# EAGLE schematic relay-simple (EAGLE 6.4)
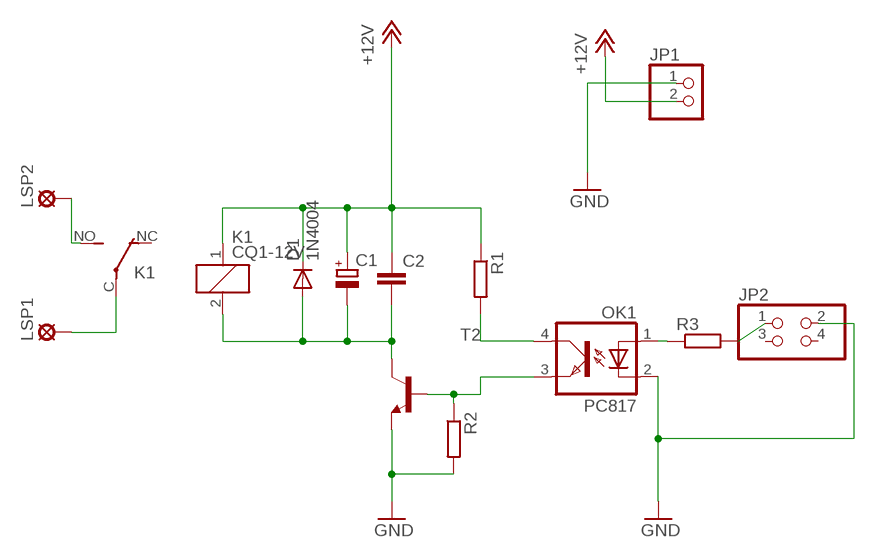
[diagram p0: schematic, sheet 1]

## Parts
C1  CPOL-EUE2-5  [E2-5]
C2  C-EUC1206  [C1206]
D1  1N4004  [DO41-10]
JP1  PINHD-1X2  [1X02]
JP2  PINHD-2X2  [2X02]
K1  CQ1-12V  [CQ1]
LSP1  LSP10  [LSP10]
LSP2  LSP10  [LSP10]
OK1  PC817  [DIL04]
R1  R-EU_R1206  [R1206]
R2  R-EU_R1206  [R1206]
R3  R-EU_R1206  [R1206]
T2  -NPN-TO92  [TO92]

## Nets
+12V: C1.+ C2.1 D1.C JP1.2 K1.1 R1.1
GND: JP1.1 JP2.2 OK1.2(C) R2.2 T2.1(E)
N$1: OK1.3(EMIT) R2.1 T2.2(B)
N$2: C1.- C2.2 D1.A K1.2 T2.3(C)
N$3: OK1.4(COL) R1.2
N$4: OK1.1(A) R3.1
N$5: JP2.1 R3.2
N$6 [power]: K1.C(2:P) LSP1.MP
N$7 [power]: K1.NO(2:S) LSP2.MP
Unconnected: JP2.3 JP2.4 K1.NC(2:O)

## Library data of the parts
C1 = rcl:CPOL-EU: POLARIZED CAPACITOR, European symbol
C2 = rcl:C-EU: CAPACITOR, European symbol
D1 = diode:1N4004: DIODE general purpose rectifier, 1 A
JP1 = pinhead:PINHD-1X2: PIN HEADER
JP2 = pinhead:PINHD-2X2: PIN HEADER
K1 = relay:CQ1-12V: AUTOMOTIVE QUIET RELAY NAiS Source: http://www.mew-europe.com/.. en_ds_61208_0000.pdf; OC_FARNELL: unknown; OC_NEWARK: unknown
LSP1 LSP2 = solpad:LSP10: SOLDER PAD drill 1.0 mm, distributor Buerklin, 12H555
OK1 = optocoupler:PC817: SHARP OPTO COUPLER; MPN: PC817X4J000F; OC_FARNELL: 9707727; OC_NEWARK: 97K7059
R1-R3 = rcl:R-EU_: RESISTOR, European symbol
T2 = transistor:*-NPN-: NPN Transistror BF959 corrected 2008.03.06

## Net classes
0 default: width 0.457 mm
1 power: width 1.219 mm